# EasyEDA Pro project ProPrj_承载我所有幻想的键盘_2025-02-09.epro, schematic 05-Schematic
Create Date: 2024-07-30; Page Name: P1; Project Name: 承载我所有幻想的键盘; Schematic Name: Schematic1_1; Update Date: 2024-07-30
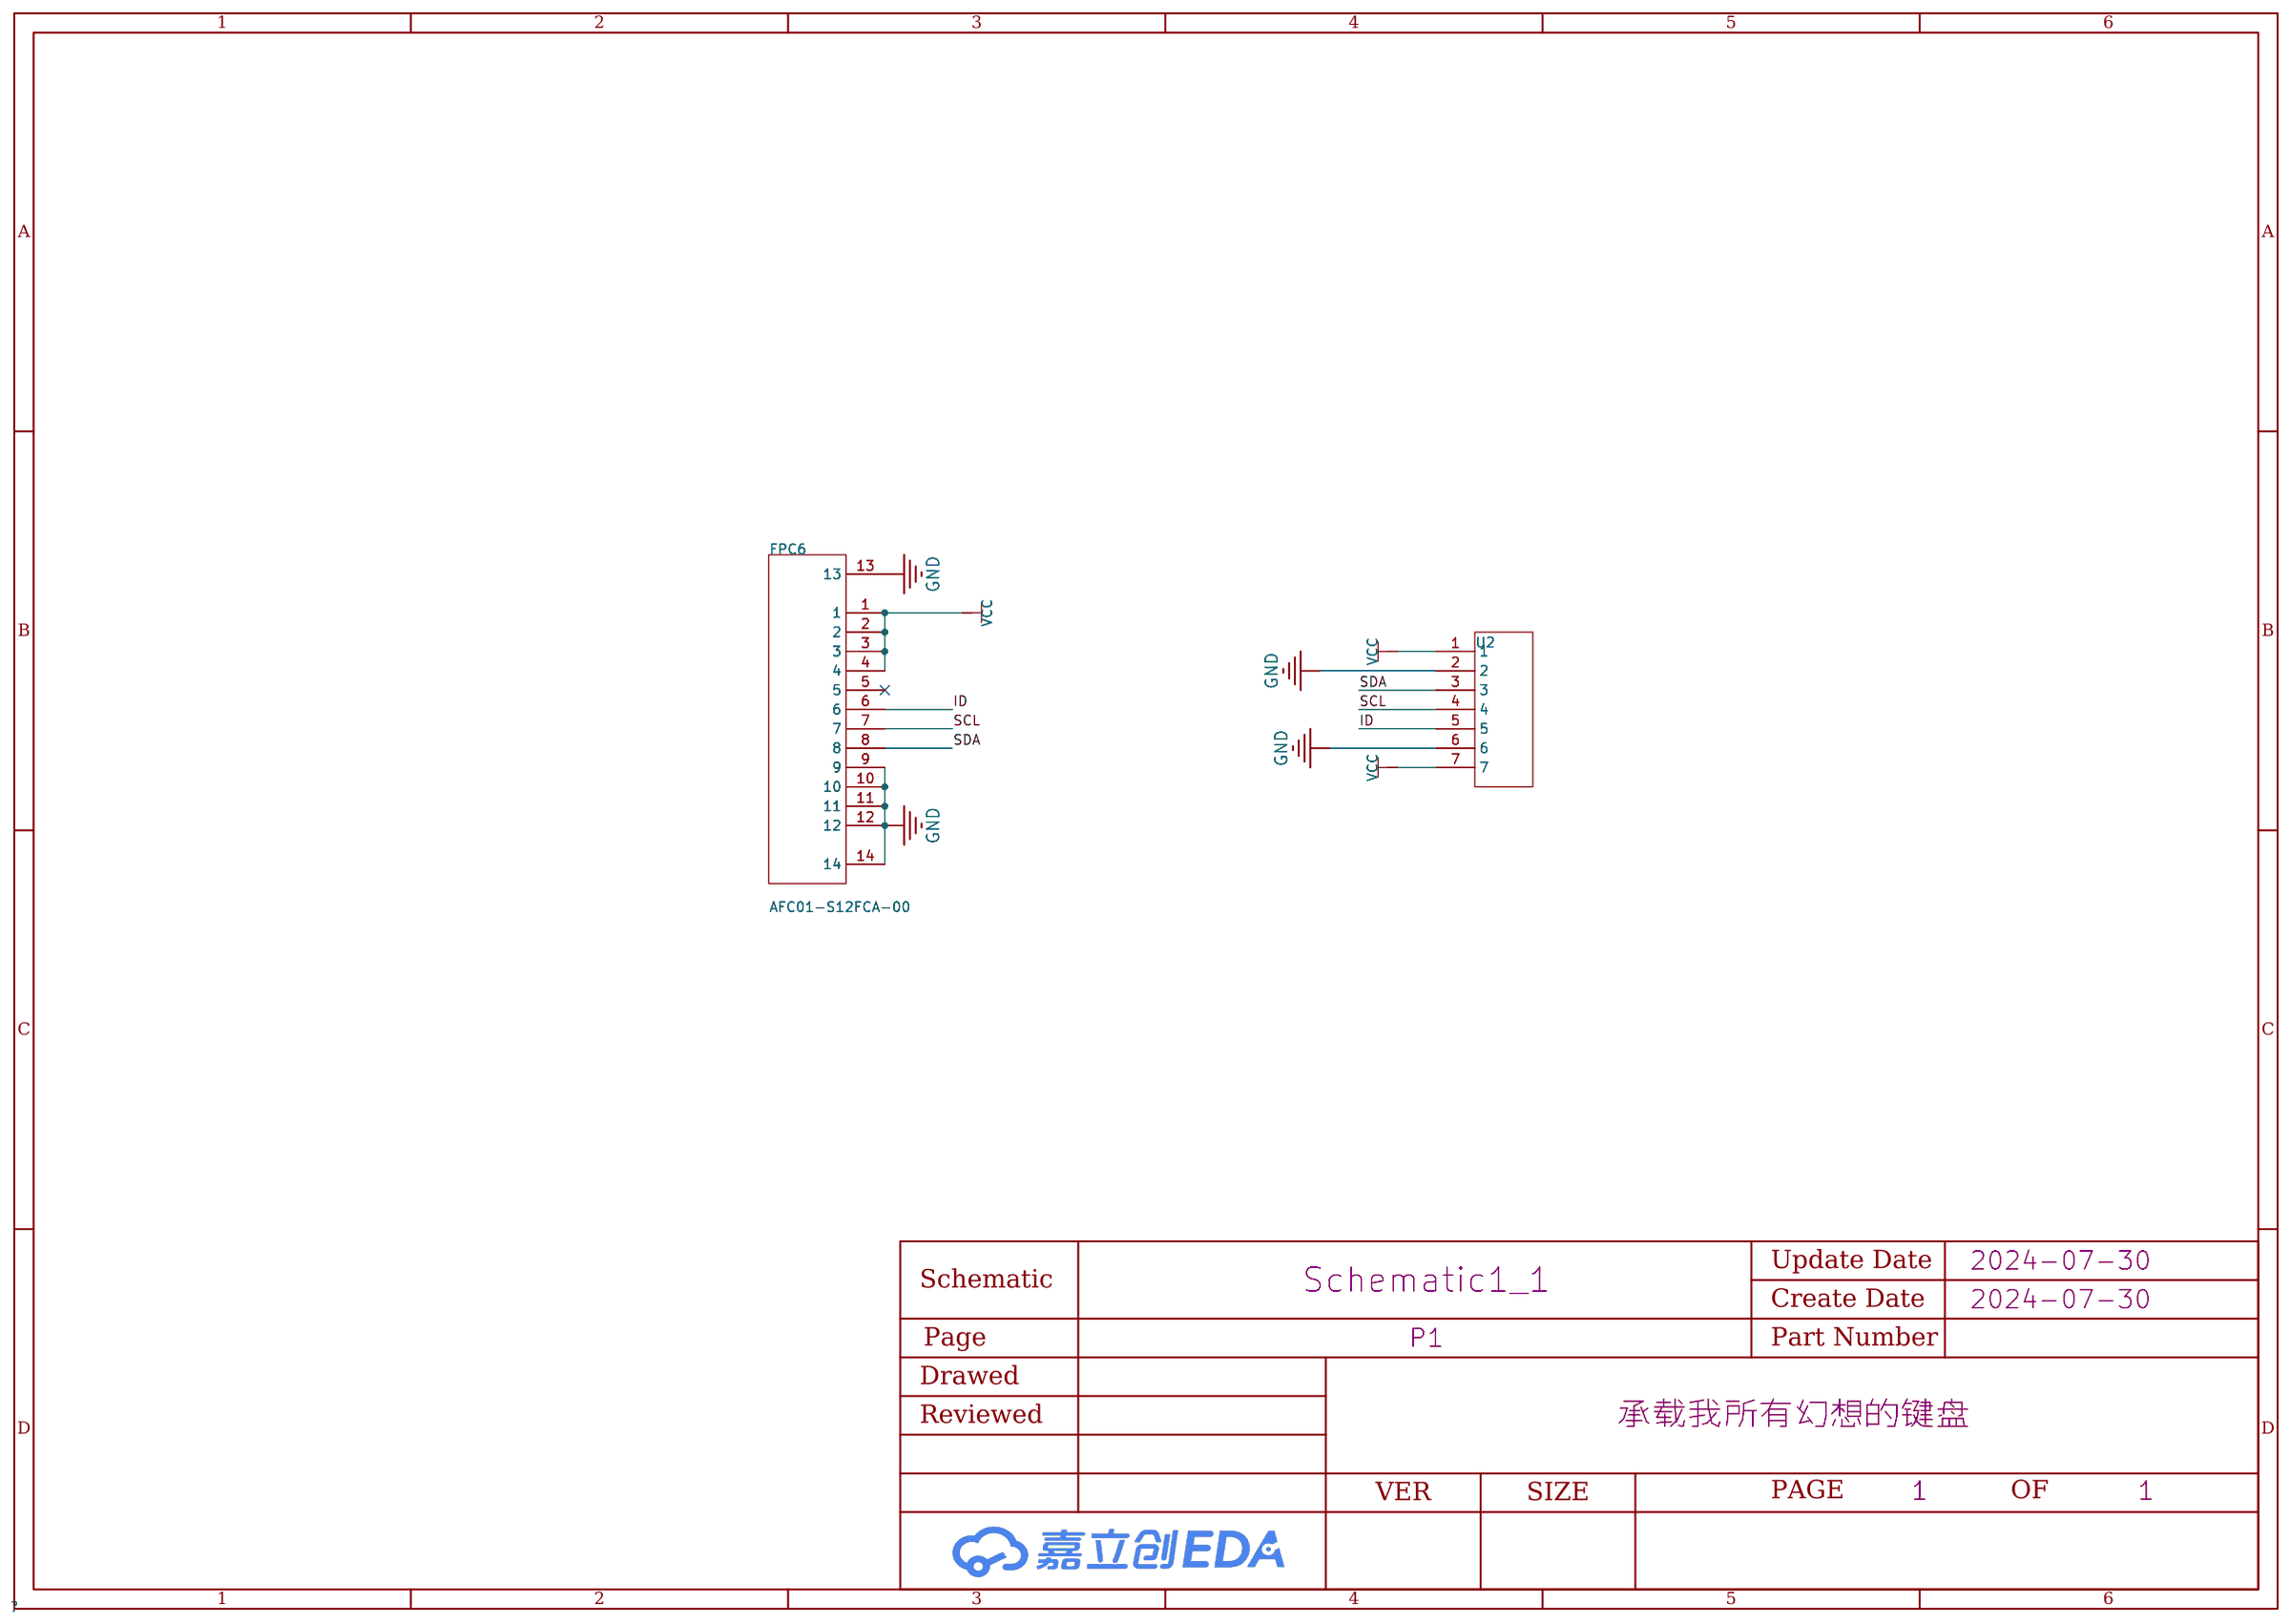
[diagram p13: schematic sheet]

## Parts
FPC6  AFC01-S12FCA-00  [FPC-SMD_AFC01-S12FCA-00]
U2  -  [7P磁吸接口]

## Library data of the parts
FPC6 = AFC01-S12FCA-00: 锁定特性:翻盖式;触点类型:下接;触点数量:12P;间距:0.5mm;安装类型:卧贴;; LCSC Part Name: 间距:0.5mm P数:12P 翻盖式 下接; Supplier Part: C262661; Manufacturer: JS(钜硕电子); Supplier Footprint: SMD,P=0.5mm,卧贴; JLCPCB Part Class: 扩展库; Datasheet: https://atta.szlcsc.com/upload/public/pdf/source/20190816/C413942_2A72D1AC756EAE17EEDF756A339D4500.pdf; Supplier: LCSC; Locking Feature: 翻盖式; Contact Type: 下接; Number of Contacts: 12P; Pitch: 0.5mm; Mounting Type: 卧贴; FFC, FCB Thickness: 0.3mm; Height Above Board: 2mm
U2 = 7P磁吸接口

## Nets
GND: FPC6.9 FPC6.10 FPC6.11 FPC6.12 FPC6.13 FPC6.14 U2.2 U2.6
VCC: FPC6.1 FPC6.2 FPC6.3 FPC6.4 U2.1 U2.7
ID: FPC6.6 U2.5
SCL: FPC6.7 U2.4
SDA: FPC6.8 U2.3

Not connected (* = marked no-connect by the designer): FPC6 5*
